# Altium project RPI_Hat.PrjPcb
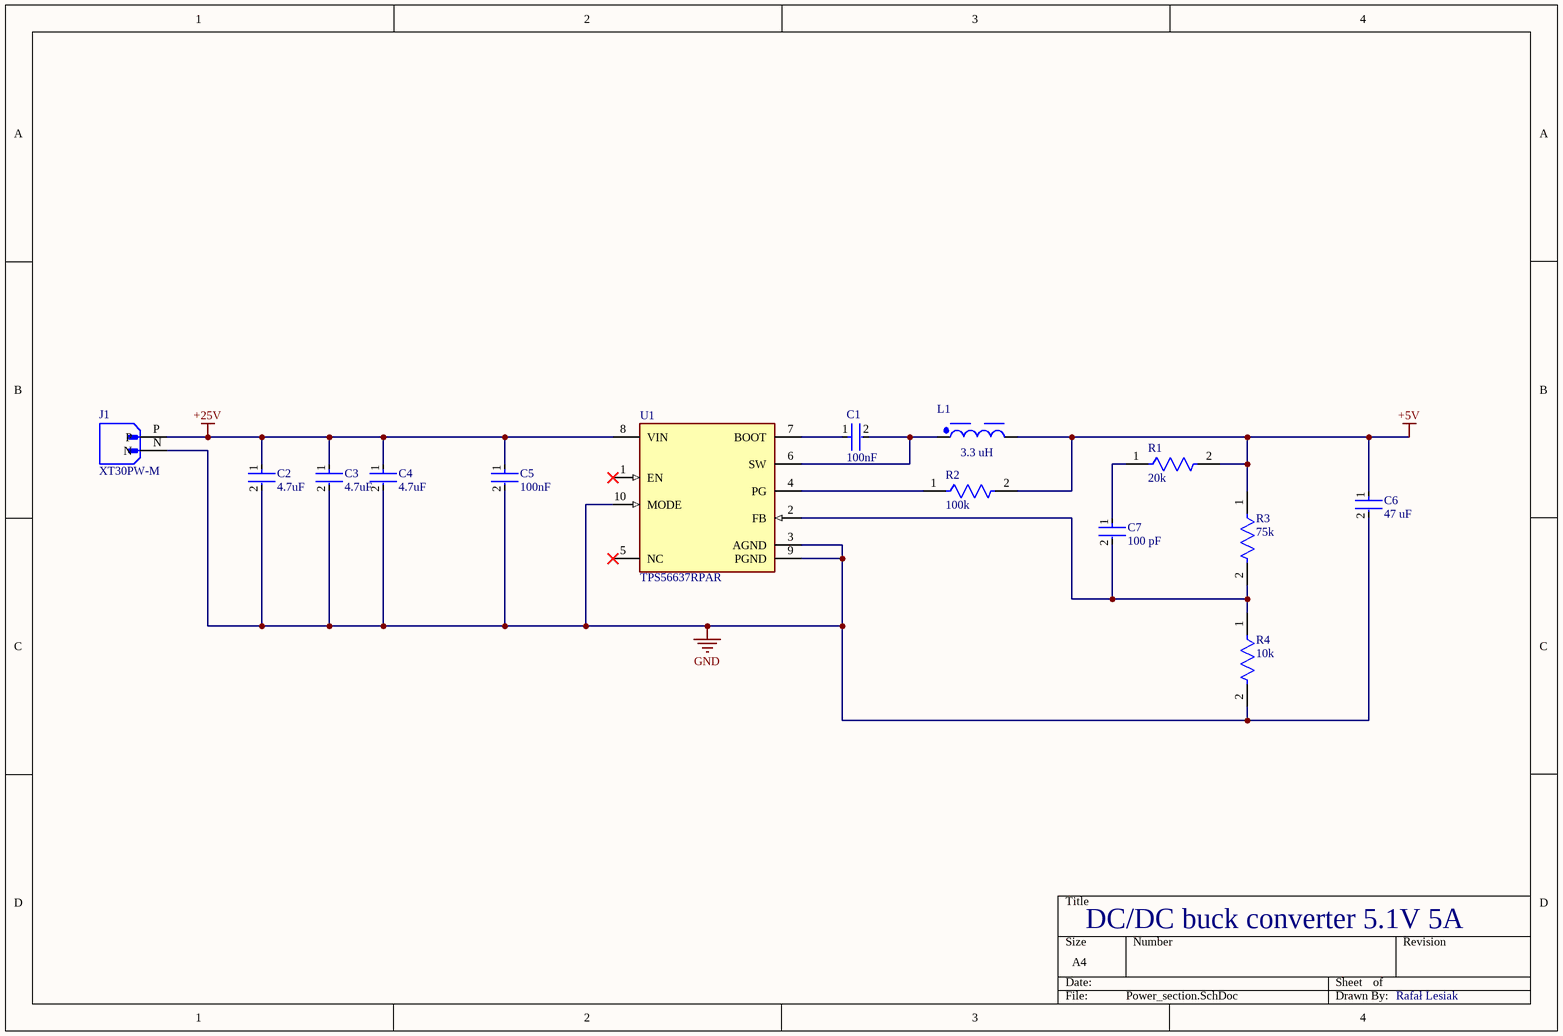
[diagram p0: Power_section.SchDoc]
2 sheets, 54 parts. Net scope: flat (ports and power ports of the same name join across sheets).
Board file: RPI_Hat.PcbDoc
Sheets:
  Power_section.SchDoc
  ESPC3_schematic.SchDoc

## Sheet Power_section.SchDoc
size A4; SheetNumber: 2; SheetTotal: 3

### Parts
C1  100nF  [FP-GRM188-0_1-e0_2_0_5-MFG]
C2  4.7uF  [FP-CC0805-0_85-MFG]
C3  4.7uF  [FP-CC0805-0_85-MFG]
C4  4.7uF  [FP-CC0805-0_85-MFG]
C5  100nF  [FP-GRM188-0_1-e0_2_0_5-MFG]
C6  47 uF  [FP-GRM32E-0_3-0_2-IPC_C]
C7  100 pF  [FP-C0201-AB-MFG]
J1  XT30PW-M  [AMASS_XT30PW-M]
L1  3.3 uH  [WE-PD_1260P]
R1  20k  [FP-AC0402-IPC_A]
R2  100k  [FP-CRCW0402-e3-IPC_C]
R3  75k  [FP-CR0402-IPC_C]
R4  10k  [FP-AC0402-IPC_C]
U1  TPS56637RPAR  [FP-RPA0010A-MFG]

### Nets
+5V: C6.1 L1.2 R1.2 R2.2 R3.1
+25V: C2.1 C3.1 C4.1 C5.1 J1.P U1.8(VIN)
GND: C2.2 C3.2 C4.2 C5.2 C6.2 J1.N R4.2 U1.3(AGND) U1.9(PGND) U1.10(MODE)
NetC1_1: C1.1 U1.7(BOOT)
NetC1_2: C1.2 L1.1 U1.6(SW)
NetC7_1: C7.1 R1.1
NetC7_2: C7.2 R3.2 R4.1 U1.2(FB)
NetR2_1: R2.1 U1.4(PG)

Not connected (* = marked no-connect by the designer): U1 1(EN)* 5(NC)*

### Notes on the sheet
- DC/DC buck converter 5.1V 5A
- Rafał Lesiak

### Library data of the parts
C1 C5 = CMP-06035-031811-1: Chip Multilayer Ceramic Capacitors for General Purpose, 0603, 0.10uF, X7R, 15%, 20%, 100V; Capacitance: 100nF; Thickness: 800um; Tolerance: 20%; Voltage Rating (DC): 100V; Length: 1.6mm; Width: 800um; Dielectric: X7R
C2-C4 = CMP-03422-000966-1: CAP CER 4.7UF 50V X5R 0805; Manufacturer: Yageo; Manufacturer Part Number: CC0805KKX5R9BB475; Tolerance: 0.1; Material: Ceramic; Capacitance: 4.7 uF; Value: 4.7 uF; Height: 0.95mm; Category: Cap; ComponentLink2Description: Datasheet; Lead Free: Yes; Voltage Rating: 50 V; Device Class L2: Capacitors; Temperature Range High: +85°C; ComponentLink2URL: http://www.yageo.com/documents/recent/UPY-GPHC_Y5V_6.3V-to-50V_8.pdf; Ipc Land Pattern Name: CAPC200125X85; Octopart: https://octopart.com/cc0805kkx5r9bb475-yageo-81932641; Temperature Range Low: -30°C; Digikey Description: CAP CER 4.7UF 50V X5R 0805; Package: CC0805-0.85; Device Class L1: Passive Components; RoHS: TRUE; Temperature Characteristic: X5R; Device Class L3: Ceramic Capacitors; Automotive: No; Temperature: -30°C to +85°C; Footprint Url: http://www.yageo.com/exep/pages/download/literatures/UPY-C_GEN_24.pdf
C6 = CMP-2000-06362-2: CAP CER 47UF 16V X5R 1210; Tolerance: 10%; Material: Ceramic; Case Code (Metric): 3225; RoHS Compliant: Yes; Min Operating Temperature: -55°C; Radiation Hardening: No; Voltage: 16V; Package Quantity: 1; Case Code (Imperial): 1210; REACH SVHC: No SVHC; Capacitance: 47uF; Voltage Rating (DC): 16V; Dielectric: X5R; Case/Package: 1210; Length: 3.2mm; Voltage Rating: 16V; Packaging: Cut Tape; Width: 0.098inch; Number of Pins: 2; Lead Free: Lead Free; Height: 2.5mm; Mount: Surface Mount; Termination: SMD/SMT; Max Operating Temperature: 85°C; Thickness: 0.106inch; Depth: 2.5mm
C7 = CMP-03020-034480-1: CAP CER 100PF 25V 5% NP0 0201; Manufacturer: KEMET; Manufacturer Part Number: C0201C101K3GACTU; Standoff Height: 0mm; Temperature Coefficient: 30ppm/°C; Tolerance: 0.1; Temperature Characteristic: C0G; Material: Ceramic; Value: 100 pF; Package: C0201-AB; Device Class L1: Passive Components; Device Class L3: Ceramic Capacitors; Automotive: No; Temperature Range Low: -55°C; Temperature Range High: +125°C; Octopart: https://octopart.com/c0201c101k3gactu-kemet-17054818; Ipc Land Pattern Name: CAPC6030X30; ComponentLink2URL: https://content.kemet.com/datasheets/KEM_C1003_C0G_SMD.pdf; Height: 0.33mm; Voltage Rating: 25 V; Lead Free: Yes; ComponentLink2Description: Datasheet; Digikey Description: CAP CER 100PF 25V 5% NP0 0201; Device Class L2: Capacitors; Capacitance: 100 pF; Temperature: -55°C to +125°C; Mouser Description: Multilayer Ceramic Capacitors MLCC - SMD/SMT 25volts 100pF C0G 10%; Category: Cap; RoHS: TRUE
J1 = XT30PW-M: Socket; DC supply; XT30; male; PIN: 2; on PCBs; THT; Colour: yellow; MF: AMASS; SnapEDA_Link: https://www.snapeda.com/parts/XT30PW-M/AMASS/view-part/?ref=snap; Package: None; Value: *; MP: XT30PW-M; Check_prices: https://www.snapeda.com/parts/XT30PW-M/AMASS/view-part/?ref=eda
L1 = CMP-207846-000022-3: Inductor, Aec-Q200, 3.3Uh, Shld, 9.2A Rohs Compliant: Yes; Series Resistance: 10mΩ; DC Resistance (DCR): 7.5mΩ; Self Resonant Frequency: 32.2MHz; Tolerance: 30%; Inductance: 3.3µH; Test Frequency: 100kHz; Saturation Current: 13.5A; Width: 12mm; RMS Current (Irms): 9.2A; Length: 12mm; Height: 6mm; Min Operating Temperature: -40°C; RoHS: Compliant; Ambient Temperature Range High: 110°C; Current Rating: 9.2A; Composition: Wirewound; Max Operating Temperature: 150°C; Ambient Temperature Range Low: -40°C
R1 = CMP-03412-040395-1: RES 20kΩ ±1% 0.125W 0402
R2 = CMP-2002-08123-3: RES Thick Film, 100kΩ, 1%, 0.063W, 100ppm/°C, 0402; Power Rating: 63mW; Resistance: 100kR; Voltage Rating (DC): 50V; Lead Free: Lead Free; Height: 0.35mm; Contact Plating: Tin; Min Operating Temperature: -55°C; Package Quantity: 10000; Case/Package: 0402; Temperature Coefficient: 100ppm/°C; Number of Terminations: 2; Packaging: Tape and Reel; Max Power Dissipation: 63mW; Case Code (Metric): 1005; Mount: Surface Mount; Width: 0.02inch; Termination: SMD/SMT; Length: 1mm; Number of Pins: 2; Weight: 2.3E-05oz; Radiation Hardening: No; Tolerance: 1%; Military Standard: Not; Features: Automotive AEC-Q200; Depth: 0.5mm; Composition: Thick Film; Max Operating Temperature: 155°C; Voltage Rating: 50V; Case Code (Imperial): 0402
R3 = CMP-2002-05392-2: Thick Film Chip Resistors 0402 75kΩ 0.0625W 1% 100ppm/°C; Max Power Dissipation: 63mW; Voltage Rating: 50V; Power Rating: 62.5mW; Resistance: 75kR; Min Operating Temperature: -55°C; Max Operating Temperature: 125°C; Mount: Surface Mount; Radiation Hardening: No; Depth: 0.5mm; Case Code (Imperial): 0402; Length: 1mm; Number of Terminations: 2; Case Code (Metric): 1005; Case/Package: 0402; Package Quantity: 10000; Temperature Coefficient: 100ppm/°C; Contact Plating: Tin; Composition: Thick Film; Thickness: 356um; Termination: SMD/SMT; Tolerance: 1%; Packaging: Tape and Reel; Width: 0.5mm; Height: 0.016inch; Military Standard: Not
R4 = CMP-03412-044365-1: RES 10kΩ ±1% 0.125W 0402; RoHS Compliant: Yes
U1 = CMP-04918-000008-1: IC POWER MANAGEMENT; Manufacturer: Texas Instruments; Max Duty Cycle: 91%; Nominal Supply Current: 140uA; Max Supply Voltage: 28V; Output Current: 6A; Switching Frequency: 500kHz; Output Type: AdjustableProgrammable; Max Junction Temp: +150°C; Output Voltage: 0.6-13V; Switching Topology: Buck; Standoff Height: 0mm; Number Of Outputs: 1; Min Supply Voltage: 4.5V; Automotive: No; Manufacturer Part Number: TPS56637RPAR; Lead Free: Yes; Temperature Range Low: -40°C; Digikey Description: IC POWER MANAGEMENT; Octopart: https://octopart.com/tps56637rpar-texas+instruments-97650653; Temperature: -40°C to +150°C; Device Class L3: Voltage Regulators - Switching; Temperature Range High: +150°C; Package: RPA0010A; Device Class L2: Power Management ICs; ComponentLink2URL: http://www.ti.com/lit/ds/symlink/tps56637.pdf; Device Class L1: Integrated Circuits (ICs); RoHS: TRUE; ComponentLink2Description: Datasheet; Height: 1mm; Category: IC

## Sheet ESPC3_schematic.SchDoc
size A4; SheetNumber: 3; SheetTotal: 3
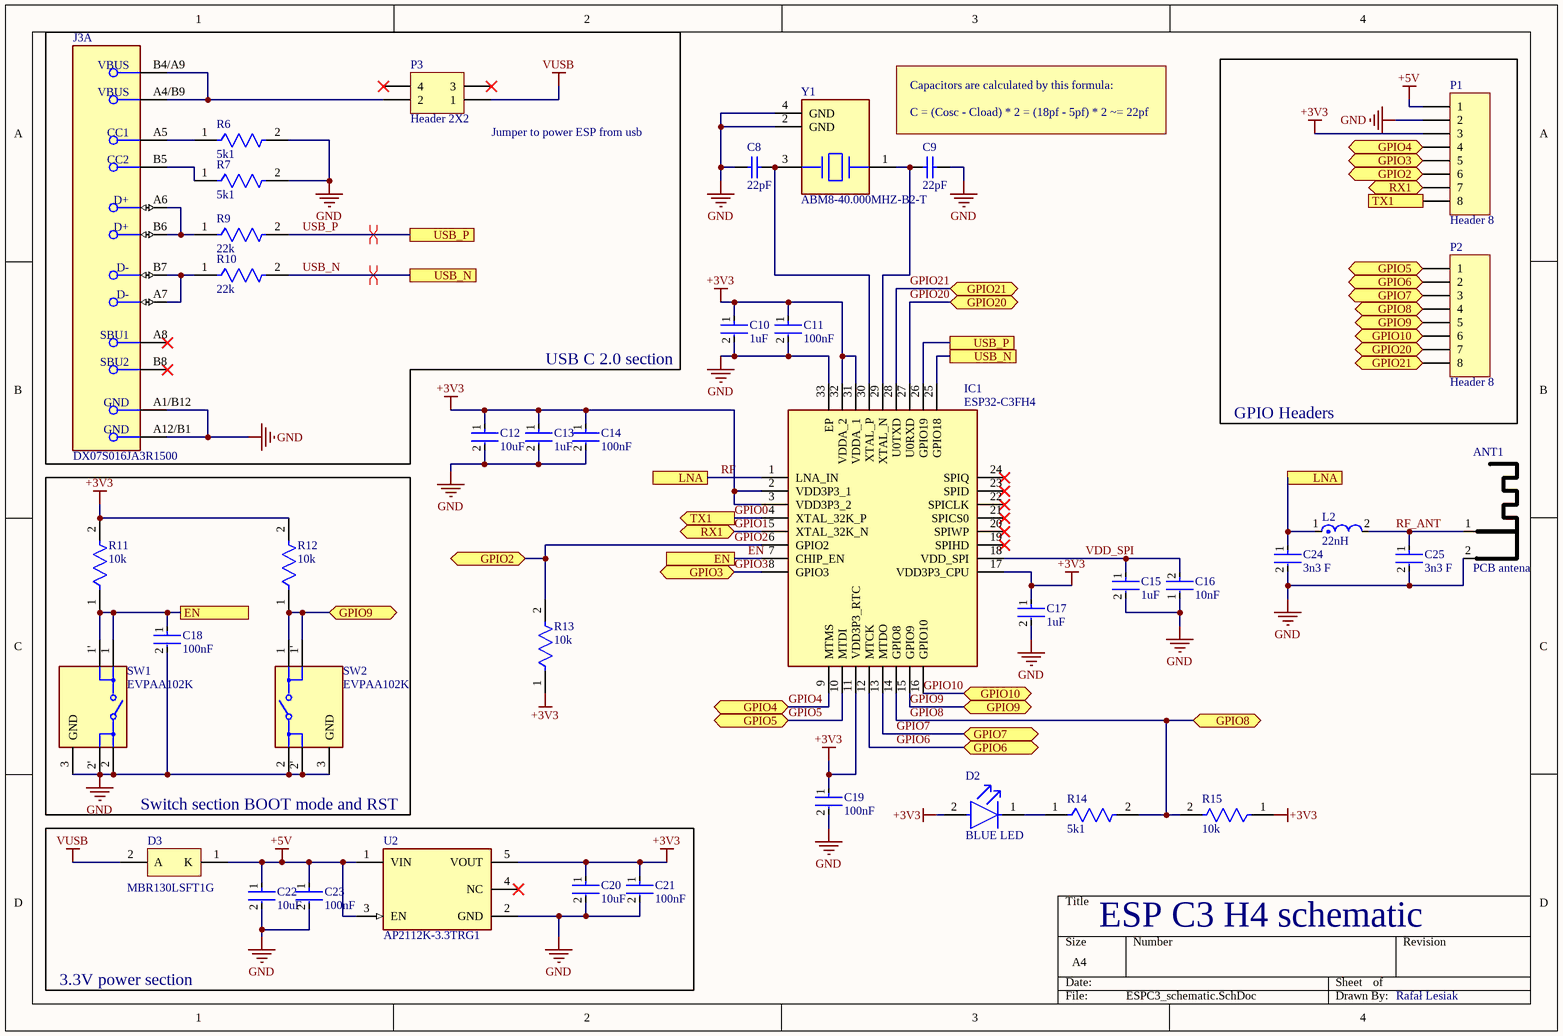
[diagram p1: ESPC3_schematic.SchDoc]

### Parts
ANT1  PCB antena  [ANT_PCB_2_4GHz]
C8  22pF  [CAPC0603X33X15LL03T05]
C9  22pF  [CAPC0603X33X15LL03T05]
C10  1uF  [FP-GRM033-0_05-e01_0_2-MFG]
C11  100nF  [FP-GRM033-0_03-MFG]
C12  10uF  [FP-GRM155-0_2-IPC_A]
C13  1uF  [FP-GRM033-0_05-e01_0_2-MFG]
C14  100nF  [FP-GRM033-0_03-MFG]
C15  1uF  [FP-GRM033-0_05-e01_0_2-MFG]
C16  10nF  [FP-GCM033-0_03-MFG]
C17  1uF  [FP-GRM033-0_05-e01_0_2-MFG]
C18  100nF  [FP-GRM033-0_03-MFG]
C19  100nF  [FP-GRM033-0_03-MFG]
C20  10uF  [FP-GRM155-0_2-IPC_A]
C21  100nF  [FP-GRM033-0_03-MFG]
C22  10uF  [FP-GRM155-0_2-IPC_A]
C23  100nF  [FP-GRM033-0_03-MFG]
C24  3n3 F  [FP-GRM022-0_02-IPC_C]
C25  3n3 F  [FP-GRM022-0_02-IPC_C]
D2  BLUE LED  [FP-LTST-C191TBKT-MFG]
D3  MBR130LSFT1G  [ONSC-SOD-123FL-2-498_V]
IC1  ESP32-C3FH4  [QFN50P500X500X90-33N-D]
J3  DX07S016JA3R1500  [FP-DX07S016JA3R1500-MFG]  (part A of 2)
L2  22nH  [FP-LQP03PN_02-MFG]
P1  Header 8  [HDR1X8]
P2  Header 8  [HDR1X8]
P3  Header 2X2  [HDR2X2]
R6  5k1  [FP-AF0201-IPC_C]
R7  5k1  [FP-AF0201-IPC_C]
R9  22k  [FP-RMCF0201-IPC_B]
R10  22k  [FP-RMCF0201-IPC_B]
R11  10k  [FP-AC0402-IPC_C]
R12  10k  [FP-AC0402-IPC_C]
R13  10k  [FP-AC0402-IPC_C]
R14  5k1  [FP-AF0201-IPC_C]
R15  10k  [FP-AC0402-IPC_C]
SW1  EVPAA102K  [FP-EVPAA102K-MFG]
SW2  EVPAA102K  [FP-EVPAA102K-MFG]
U2  AP2112K-3.3TRG1  [FP-SOT25-IPC_A]
Y1  ABM8-40.000MHZ-B2-T  [FP-ABM8-MFG]

### Blocks framed on the sheet
USB C 2.0 section: J3 P3 R6 R7 R9 R10
GPIO Headers: P1 P2
Switch section BOOT mode and RST: C18 R11 R12 SW1 SW2

### Ports
EN (see ESPC3_schematic[1C]), EN (see ESPC3_schematic[2C]), GPIO2 (bidir, see ESPC3_schematic[2C]), GPIO2 (bidir, see ESPC3_schematic[4A]), GPIO3 (bidir, see ESPC3_schematic[2C]), GPIO3 (bidir, see ESPC3_schematic[4A]), GPIO4 (bidir, see ESPC3_schematic[2C]), GPIO4 (bidir, see ESPC3_schematic[4A]), GPIO5 (bidir, see ESPC3_schematic[2C]), GPIO5 (bidir, see ESPC3_schematic[4B]), GPIO6 (bidir, see ESPC3_schematic[3C]), GPIO6 (bidir, see ESPC3_schematic[4B]), GPIO7 (bidir, see ESPC3_schematic[3C]), GPIO7 (bidir, see ESPC3_schematic[4B]), GPIO8 (bidir, see ESPC3_schematic[4B]), GPIO8 (bidir, see ESPC3_schematic[4C]), GPIO9 (bidir, see ESPC3_schematic[1C], ESPC3_schematic[3C]), GPIO9 (bidir, see ESPC3_schematic[1C], ESPC3_schematic[4B]), GPIO9 (bidir, see ESPC3_schematic[3C], ESPC3_schematic[4B]), GPIO10 (bidir, see ESPC3_schematic[3C]), GPIO10 (bidir, see ESPC3_schematic[4B]), GPIO20 (bidir, see ESPC3_schematic[3B]), GPIO20 (bidir, see ESPC3_schematic[4B]), GPIO21 (bidir, see ESPC3_schematic[3B]), GPIO21 (bidir, see ESPC3_schematic[4B]), LNA (see ESPC3_schematic[2B]), LNA (see ESPC3_schematic[4B]), RX1 (bidir, see ESPC3_schematic[2C], Rasberry_pi_connections[3B]), RX1 (bidir, see ESPC3_schematic[4A], Rasberry_pi_connections[3B]), TX1 (out, see ESPC3_schematic[2C], Rasberry_pi_connections[2B]), TX1 (out, see ESPC3_schematic[4A], Rasberry_pi_connections[2B]), USB_N (see ESPC3_schematic[2B]), USB_N (see ESPC3_schematic[3B]), USB_P (see ESPC3_schematic[2A]), USB_P (see ESPC3_schematic[3B])

### Nets
+3V3: C10.1 C11.1 C12.1 C13.1 C14.1 C17.1 C19.1 C20.1 C21.1 D2.2(A) IC1.2(VDD3P3_1) IC1.3(VDD3P3_2) IC1.11(VDD3P3_RTC) IC1.17(VDD3P3_CPU) IC1.31(VDDA_1) IC1.32(VDDA_2) P1.3 R11.2 R12.2 R13.1 R15.1 U2.5(VOUT)
+5V: C22.1 C23.1 D3.1(K) P1.1 U2.1(VIN) U2.3(EN)
GND: ANT1.2(GND) C8.1 C9.2 C10.2 C11.2 C12.2 C13.2 C14.2 C15.2 C16.1 C17.2 C18.2 C19.2 C20.2 C21.2 C22.2 C23.2 C24.2 C25.2 IC1.33(EP) J3.A1/B12(GND) J3.A12/B1(GND) P1.2 R6.2 R7.2 SW1.2 SW1.2' SW1.3(GND) SW2.2 SW2.2' SW2.3(GND) U2.2(GND) Y1.2(GND) Y1.4(GND)
VUSB: D3.2(A) P3.1
EN: C18.1 IC1.7(CHIP_EN) R11.1 SW1.1 SW1.1' ; port EN
GPIO0: IC1.4(XTAL_32K_P) P1.8 ; port TX1
GPIO1: IC1.5(XTAL_32K_N) P1.7 ; port RX1
GPIO2: IC1.6(GPIO2) P1.6 R13.2 ; port GPIO2
GPIO3: IC1.8(GPIO3) P1.5 ; port GPIO3
GPIO4: IC1.9(MTMS) P1.4 ; port GPIO4
GPIO5: IC1.10(MTDI) P2.1 ; port GPIO5
GPIO6: IC1.12(MTCK) P2.2 ; port GPIO6
GPIO7: IC1.13(MTDO) P2.3 ; port GPIO7
GPIO8: IC1.14(GPIO8) P2.4 R14.2 R15.2 ; port GPIO8
GPIO9: IC1.15(GPIO9) P2.5 R12.1 SW2.1 SW2.1' ; port GPIO9
GPIO10: IC1.16(GPIO10) P2.6 ; port GPIO10
GPIO20: IC1.27(U0RXD) P2.7 ; port GPIO20
GPIO21: IC1.28(U0TXD) P2.8 ; port GPIO21
RF: C24.1 IC1.1(LNA_IN) L2.1 ; port LNA
RF_ANT: ANT1.1(RF) C25.1 L2.2
USB_N: IC1.25(GPIO18) R10.2 ; port USB_N
USB_P: IC1.26(GPIO19) R9.2 ; port USB_P
VDD_SPI: C15.1 C16.2 IC1.18(VDD_SPI)
NetC8_2: C8.2 IC1.30(XTAL_P) Y1.3
NetC9_1: C9.1 IC1.29(XTAL_N) Y1.1
NetD2_1: D2.1(C) R14.1
NetJ3_A4/B9: J3.A4/B9(VBUS) J3.B4/A9(VBUS) P3.2
NetJ3_A5: J3.A5(CC1) R6.1
NetJ3_A6: J3.A6(D+) J3.B6(D+) R9.1
NetJ3_A7: J3.A7(D-) J3.B7(D-) R10.1
NetJ3_B5: J3.B5(CC2) R7.1

Not connected (* = marked no-connect by the designer): IC1 19(SPIHD)* 20(SPIWP)* 21(SPICS0)* 22(SPICLK)* 23(SPID)* 24(SPIQ)*; J3 A8(SBU1)* B8(SBU2)*; P3 3* 4*; U2 4(NC)*

### Layout directives
differential pair: USB_N, USB_P

### Notes on the sheet
- (near Y1) Capacitors are calculated by this formula:
- C = (Cosc - Cload) * 2 = (18pf - 5pf) * 2 ~= 22pf
- (near P3) Jumper to power ESP from usb
- 3.3V power section
- ESP C3 H4 schematic
- Rafał Lesiak

### Library data of the parts
ANT1 = ANT_PCB_2.4GHz: PCB antena 2.4GHz 50ohm from AN043 texas instrument; ComponentLink1Description: Aplication note; ComponentLink1URL: https://www.ti.com/lit/an/swra117d/swra117d.pdf
C8 C9 = CMP-2010-00172-1: Manufacturer: AVX Interconnect / Elco; Part Number: 0201YA220JAT2A
C10 C13 C15 C17 = CMP-06035-050598-1: Chip Multilayer Ceramic Capacitors for General Purpose, 0201, 1.0uF, X5R, 15%, 20%, 10V
C11 C14 C18 C19 C21 C23 = CMP-06035-019237-1: Chip Multilayer Ceramic Capacitors for General Purpose, 0201, 0.10uF, X7S, 22%, 10%, 10V; Voltage Rating (DC): 10V; Width: 300um; Tolerance: 10%; Thickness: 300um; Capacitance: 100nF; Dielectric: X7S; Length: 600um
C12 C20 C22 = CMP-06035-026070-1: Chip Multilayer Ceramic Capacitors for General Purpose, 0402, 10uF, X5R, 15%, 20%, 10V
C16 = CMP-06035-038894-1: Ceramic Capacitor for Automotive 10nF  ±10% 10VDC X7R 0201 Paper T/R; Voltage Rating (DC): 10V; Case/Package: Ceramic; Capacitance: 10nF; Dielectric: X7R; Tolerance: 10%
C24 C25 = CMP-06035-053620-1: Chip Multilayer Ceramic Capacitors for General Purpose, 01005, 3.3pF, C0G, 30ppm/°C, 0.25pF, 16V
D2 = CMP-22017-000008-1: LED BLUE CLEAR CHIP SMD; Lens Color: Colorless; Dominant Wavelength: 475nm; Forward Current: 20mA; Wavelength: 468nm; Viewing Angle: 130°; Power Dissipation: 76mW; Luminous Intensity: 180mcd; Reverse Voltage: 5V; Number of Elements: 1; Lens Style: Diffused; Forward Voltage: 3.8V; Max Power Dissipation: 75mW; Case Code (Metric): 1608; Packaging: Tape and Reel; Case/Package: 0603; Depth: 1.6mm; Mount: Surface Mount; Lead Free: Lead Free; Min Operating Temperature: -20°C; Lens Transparency: Clear; Illumination Color: Blue; Height: 0.55mm; Test Current: 20mA; Case Code (Imperial): 0603; Max Operating Temperature: 80°C; Number of Pins: 2; Length: 0.8mm; Radiation Hardening: No; Package Quantity: 1; Number of LEDs: 1; Width: 0.8mm; Color: Blue
D3 = CMP-1055-00430-1: Schottky Power Rectifier, 2-Pin SOD-123, Pb-Free, Tape and Reel; Manufacturer: On Semiconductor; Configuration: Single; IFSM Max (A): 40; Packing: Tape and Reel; ComponentLink1URL: http://www.onsemi.com/; Mounting Technology: Surface Mount; ComponentLink1Description: Manufacturer URL; PartNumber: MBR130LSFT1G; PackageDescription: 2-Pin SOD, Body 1.65 x 2.7 mm; ComponentLink3URL: http://www.onsemi.com/pub_link/Collateral/498-01.PDF; ComponentLink2URL: http://www.onsemi.cn/pub_link/Collateral/MBR130LSFT1-D.PDF; PackageVersion: Rev. D, 05/2013; RoHS: TRUE; DatasheetVersion: Rev. 3; PackageReference: SOD-123FL-2-498; ComponentLink3Description: Package Specification; ComponentLink2Description: Datasheet
IC1 = ESP32-C3FH4: Integrated Circuit; Manufacturer_Name: Espressif Systems; Datasheet Link: https://www.espressif.com/sites/default/files/documentation/esp32-c3_datasheet_en.pdf; Height: 0.9mm; Manufacturer_Part_Number: ESP32-C3FH4; Mouser Part Number: 356-ESP32-C3FH4; Mouser Price/Stock: https://www.mouser.co.uk/ProductDetail/Espressif-Systems/ESP32-C3FH4?qs=iLbezkQI%252BsgL5PSvEueYlQ%3D%3D
J3 = CMP-19038-000002-1: CONN RCP USB2.0 TYP C 24P SMD RA
L2 = CMP-06042-000709-1: Film type RF Inductor 22nH ±5% 140mA 2.85Ω 0201 (0603); Q Factor: 9; Core Material: Ferrite; Shielding: Unshielded; Self Resonant Frequency: 2.5GHz; DC Resistance (DCR): 2.85R; Test Frequency: 500MHz; Width: 0.012inch; Tolerance: 5%; Packaging: Tape and Reel; Inductance: 22nH; Military Standard: Not; Max DC Current: 140mA; Termination: SMD/SMT; Length: 0.024inch; Depth: 0.33mm; Max Operating Temperature: 125°C; Current Rating: 140mA; Mount: Surface Mount; Resistor Type: Thin Film; Case/Package: 0201; Height: 0.85mm; Weight: 6E-06oz; Height - Seated (Max): 0.013inch; Package Quantity: 15000; Case Code (Imperial): 0201; Min Operating Temperature: -55°C; DC Current: 140mA; Case Code (Metric): 0603
P1 P2 = Header 8: Header, 8-Pin; LatestRevisionDate: 17-Jul-2002; LatestRevisionNote: Re-released for DXP Platform.; Publisher: Altium Limited
P3 = Header 2X2: Header, 2-Pin, Dual row; LatestRevisionDate: 17-Jul-2002; LatestRevisionNote: Re-released for DXP Platform.; Publisher: Altium Limited
R6 R7 R14 = CMP-03412-047927-1: Anti-Sulfurated Chip Resistors Automotive Grade 5.1kΩ 1% 200ppm/°C 0201; Resistance: 5.1kR; Max Power Dissipation: 50mW; Packaging: Tape and Reel; Features: Moisture Resistant; Height: 0.01inch; Length: 0.024inch; Min Operating Temperature: -55°C; RoHS Compliant: Yes; Max Operating Temperature: 125°C; Width: 0.012inch; Resistor Type: Thick Film; Tolerance: 1%; Series: AF; Number of Terminations: 2; Case/Package: 0201; Temperature Coefficient: 200ppm/°C
R9 R10 = CMP-26527-001675-1: 22kΩ ±5% 0.05W 0201 Thick Film Chip Resistor AEC-Q200 compliant; Resistance: 22kR; Temperature Coefficient: 200ppm/°C; Max Power Dissipation: 50mW; Height: 0.009inch; Radiation Hardening: No; RoHS Compliant: Yes; Number of Terminations: 2; Max Operating Temperature: 125°C; Length: 0.024inch; Resistor Type: Thick Film; Case/Package: 0201; Case Code (Metric): 0603; Case Code (Imperial): 0201; Width: 0.012inch; Tolerance: 5%; Contact Plating: Tin; Mount: Surface Mount; Series: RMCF; Min Operating Temperature: -55°C; Packaging: Tape and Reel
R11-R13 R15 = CMP-03412-044365-1: RES 10kΩ ±1% 0.125W 0402; RoHS Compliant: Yes
SW1 SW2 = CMP-00287-20843803-1: EVPAA102K Switch Tactile N.O. SPST Rectangular Button J-Bend 0.02A 15VDC 1N SMD Embossed T/R; Life (Cycles): 1Mcycles; Contact Current Rating: 20mA; Number of Positions: 2; Voltage Rating (DC): 12V; Switch Travel: 150µm; Switch Function: Off-Mom; Max Voltage Rating (DC): 15V; Contact Resistance: 100mΩ; Illumination Type: Non-Illuminated; Actuator Length: 300µm; Current Rating: 50mA; Lead Free: Lead Free; Color: Black; RoHS: Compliant; Contact Plating: Silver; Height: 700µm; Min Operating Temperature: -40°C; Orientation: Straight; Length: 4.3mm; Throw Configuration: SPST; Mount: Surface Mount; Radiation Hardening: No; Electrical Life: 1Mcycles; Mechanical Life: 1Mcycles; Operating Force: 1N; Case/Package: SMD/SMT; Max Operating Temperature: 85°C; Termination: J-Bend; Depth: 2.9mm; NexarPartId: 20843803; Max Current Rating: 20mA
U2 = CMP-12756-000035-1: IC REG LINEAR 3.3V 600MA SOT25; Number of Regulators: 1; Output Type: Fixed; Polarity: Positive; Min Input Voltage: 2.5V; Max Input Voltage: 6V; Accuracy: 1.5%; Quiescent Current: 55uA; Dropout Voltage: 250mV; Min Operating Temperature: -40°C; Length: 3.1mm; Output Current: 600mA; Max Operating Temperature: 85°C; Package Quantity: 1; Output Voltage: 3.3V; Width: 1.7mm; Number of Outputs: 1; Packaging: Tape and Reel; Height: 1.3mm; Lead Free: Lead Free; Max Output Current: 600mA; Case/Package: SOT-23-5; Mount: Surface Mount; Number of Pins: 5
Y1 = CMP-27762-005193-1: Crystal 40MHz ±20ppm 18pF SMD-4 3.2mm x 2.5mm; ESR (Equivalent Series Resistance): 35R; Frequency Stability: 50ppm; Radiation Hardening: No; Operating Frequency: 40 MHz; Frequency Tolerance: 20ppm; Lead Free: Lead Free; Load Capacitance: 18pF; Package Quantity: 1000; Width: 0.098inch; Series Resistance: 35R; Frequency: 40MHz; Height: 0.031inch; Depth: 2.5mm; Tolerance: 20ppm; Number of Pins: 4; Max Operating Temperature: 70°C; Termination: SMD/SMT; Packaging: Tape and Reel; Resistor Type: Ceramic; Length: 3.2mm; Mount: Surface Mount; Case/Package: SMD/SMT; Min Operating Temperature: -20°C; Series: ABM8

## Nets that join several sheets
+5V: Power_section (5 pins), ESPC3_schematic (6 pins)
GND: Power_section (10 pins), ESPC3_schematic (34 pins)